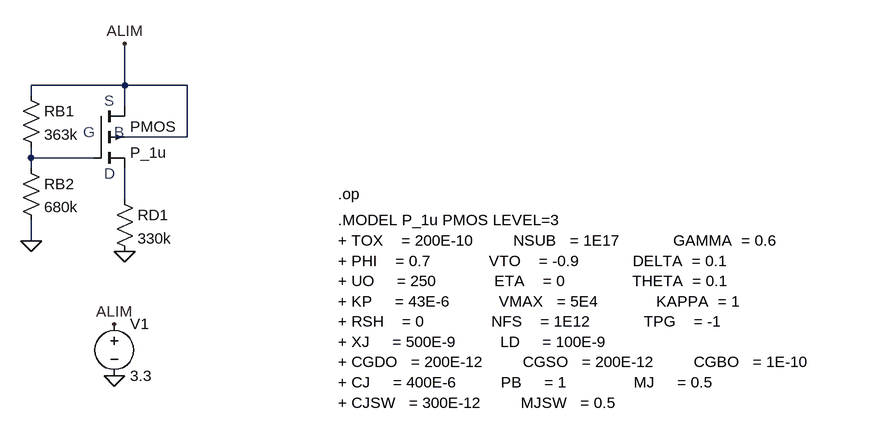
[diagram p0: schematic Simulation_gd_gm.asc]
Simulation_gd_gm.asc, the LTspice schematic file:
Version 4
SHEET 1 880 680
WIRE -656 16 -656 -48
WIRE -656 16 -800 16
WIRE -560 16 -656 16
WIRE -800 32 -800 16
WIRE -656 48 -656 16
WIRE -560 96 -560 16
WIRE -560 96 -656 96
WIRE -800 128 -800 112
WIRE -704 128 -800 128
WIRE -800 144 -800 128
WIRE -656 192 -656 144
WIRE -800 256 -800 224
FLAG -672 384 ALIM
FLAG -672 464 0
FLAG -656 272 0
FLAG -656 -48 ALIM
FLAG -800 256 0
SYMBOL voltage -672 368 R0
WINDOW 123 0 0 Left 0
WINDOW 39 0 0 Left 0
SYMATTR InstName V1
SYMATTR Value 3.3
SYMBOL pmos4 -704 48 R0
SYMATTR InstName PMOS
SYMATTR Value P_1u
SYMATTR Value2 l=1u w=2.5u
SYMBOL res -672 176 R0
SYMATTR InstName RD1
SYMATTR Value 330k
SYMBOL res -816 16 R0
SYMATTR InstName RB1
SYMATTR Value 363k
SYMBOL res -816 128 R0
SYMATTR InstName RB2
SYMATTR Value 680k
TEXT -328 184 Left 2 !.op
TEXT -688 40 Left 2 ;S
TEXT -720 88 Left 2 ;G
TEXT -672 88 Left 2 ;B
TEXT -688 152 Left 2 ;D
TEXT -328 224 Left 2 !.MODEL P_1u PMOS LEVEL=3\n+ TOX    = 200E-10         NSUB   = 1E17            GAMMA  = 0.6          \n+ PHI    = 0.7             VTO    = -0.9            DELTA  = 0.1          \n+ UO     = 250             ETA    = 0               THETA  = 0.1         \n+ KP     = 43E-6           VMAX   = 5E4             KAPPA  = 1         \n+ RSH    = 0               NFS    = 1E12            TPG    = -1                 \n+ XJ     = 500E-9          LD     = 100E-9               \n+ CGDO   = 200E-12         CGSO   = 200E-12         CGBO   = 1E-10              \n+ CJ     = 400E-6          PB     = 1               MJ     = 0.5                \n+ CJSW   = 300E-12         MJSW   = 0.5

The netlist it stands for:
* Simulation_gd_gm.asc
V1 ALIM 0 3.3
M§PMOS ALIM N001 N002 ALIM P_1u l=1u w=2.5u
RD1 N002 0 330k
RB1 ALIM N001 363k
RB2 N001 0 680k
.model NMOS NMOS
.model PMOS PMOS
.lib standard.mos
.op
* S
* G
* B
* D
.MODEL P_1u PMOS LEVEL=3
+ TOX    = 200E-10         NSUB   = 1E17            GAMMA  = 0.6
+ PHI    = 0.7             VTO    = -0.9            DELTA  = 0.1
+ UO     = 250             ETA    = 0               THETA  = 0.1
+ KP     = 43E-6           VMAX   = 5E4             KAPPA  = 1
+ RSH    = 0               NFS    = 1E12            TPG    = -1
+ XJ     = 500E-9          LD     = 100E-9
+ CGDO   = 200E-12         CGSO   = 200E-12         CGBO   = 1E-10
+ CJ     = 400E-6          PB     = 1               MJ     = 0.5
+ CJSW   = 300E-12         MJSW   = 0.5
.backanno
.end